# Altium project Tesla_MMC.PrjPcb
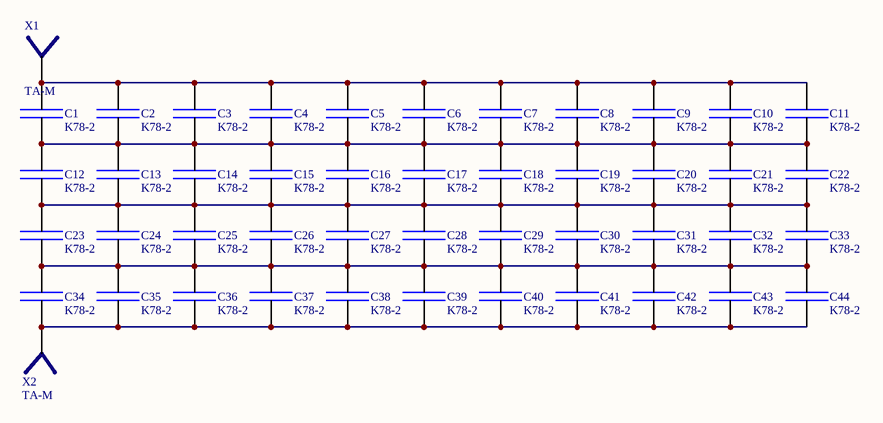
[diagram p0: Tesla_MMC.SchDoc]
1 sheet, 46 parts. Net scope: global (net labels, ports and power ports of the same name join across sheets).
Board file: Tesla_MMC.PcbDoc

## Sheet Tesla_MMC.SchDoc
size A4

### Parts
C1  K78-2  [Capasitor K78-2]
C2  K78-2  [Capasitor K78-2]
C3  K78-2  [Capasitor K78-2]
C4  K78-2  [Capasitor K78-2]
C5  K78-2  [Capasitor K78-2]
C6  K78-2  [Capasitor K78-2]
C7  K78-2  [Capasitor K78-2]
C8  K78-2  [Capasitor K78-2]
C9  K78-2  [Capasitor K78-2]
C10  K78-2  [Capasitor K78-2]
C11  K78-2  [Capasitor K78-2]
C12  K78-2  [Capasitor K78-2]
C13  K78-2  [Capasitor K78-2]
C14  K78-2  [Capasitor K78-2]
C15  K78-2  [Capasitor K78-2]
C16  K78-2  [Capasitor K78-2]
C17  K78-2  [Capasitor K78-2]
C18  K78-2  [Capasitor K78-2]
C19  K78-2  [Capasitor K78-2]
C20  K78-2  [Capasitor K78-2]
C21  K78-2  [Capasitor K78-2]
C22  K78-2  [Capasitor K78-2]
C23  K78-2  [Capasitor K78-2]
C24  K78-2  [Capasitor K78-2]
C25  K78-2  [Capasitor K78-2]
C26  K78-2  [Capasitor K78-2]
C27  K78-2  [Capasitor K78-2]
C28  K78-2  [Capasitor K78-2]
C29  K78-2  [Capasitor K78-2]
C30  K78-2  [Capasitor K78-2]
C31  K78-2  [Capasitor K78-2]
C32  K78-2  [Capasitor K78-2]
C33  K78-2  [Capasitor K78-2]
C34  K78-2  [Capasitor K78-2]
C35  K78-2  [Capasitor K78-2]
C36  K78-2  [Capasitor K78-2]
C37  K78-2  [Capasitor K78-2]
C38  K78-2  [Capasitor K78-2]
C39  K78-2  [Capasitor K78-2]
C40  K78-2  [Capasitor K78-2]
C41  K78-2  [Capasitor K78-2]
C42  K78-2  [Capasitor K78-2]
C43  K78-2  [Capasitor K78-2]
C44  K78-2  [Capasitor K78-2]
X1  TA-M  [TA-M]
X2  TA-M  [TA-M]

### Nets
NetC1_1: C1.1 C2.1 C3.1 C4.1 C5.1 C6.1 C7.1 C8.1 C9.1 C10.1 C11.1 X1.1
NetC1_2: C1.2 C2.2 C3.2 C4.2 C5.2 C6.2 C7.2 C8.2 C9.2 C10.2 C11.2 C12.1 C13.1 C14.1 C15.1 C16.1 C17.1 C18.1 C19.1 C20.1 C21.1 C22.1
NetC12_2: C12.2 C13.2 C14.2 C15.2 C16.2 C17.2 C18.2 C19.2 C20.2 C21.2 C22.2 C23.1 C24.1 C25.1 C26.1 C27.1 C28.1 C29.1 C30.1 C31.1 C32.1 C33.1
NetC23_2: C23.2 C24.2 C25.2 C26.2 C27.2 C28.2 C29.2 C30.2 C31.2 C32.2 C33.2 C34.1 C35.1 C36.1 C37.1 C38.1 C39.1 C40.1 C41.1 C42.1 C43.1 C44.1
NetC34_2: C34.2 C35.2 C36.2 C37.2 C38.2 C39.2 C40.2 C41.2 C42.2 C43.2 C44.2 X2.1

### Library data of the parts
C1-C44 = Capasitor_K78-2